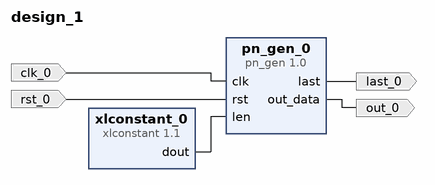
[diagram p0: block diagram of the top level]
# Vivado block design design_1, xc7z020clg484-1, Vivado 2017.4
create_bd_design design_1

create_bd_port -dir I -type clk clk_0
create_bd_port -dir I -type rst rst_0
create_bd_port -dir O out_0
create_bd_port -dir O last_0

create_bd_cell -type ip -vlnv xilinx.com:ip:xlconstant:1.1 xlconstant_0
set_property -dict {CONFIG.CONST_WIDTH 32 CONFIG.CONST_VAL 7} [get_bd_cells xlconstant_0]
create_bd_cell -type ip -vlnv xilinx.com:user:pn_gen:1.0 pn_gen_0

# ---- connections ----

connect_bd_net -net clk_0_1 [get_bd_ports clk_0] [get_bd_pins pn_gen_0/clk]
connect_bd_net -net rst_0_1 [get_bd_ports rst_0] [get_bd_pins pn_gen_0/rst]
connect_bd_net [get_bd_pins xlconstant_0/dout] [get_bd_pins pn_gen_0/len]
connect_bd_net [get_bd_pins pn_gen_0/out_data] [get_bd_ports out_0]
connect_bd_net [get_bd_pins pn_gen_0/last] [get_bd_ports last_0]

validate_bd_design
save_bd_design
